# Altium project Heart Rate Monitoring.PrjPcb
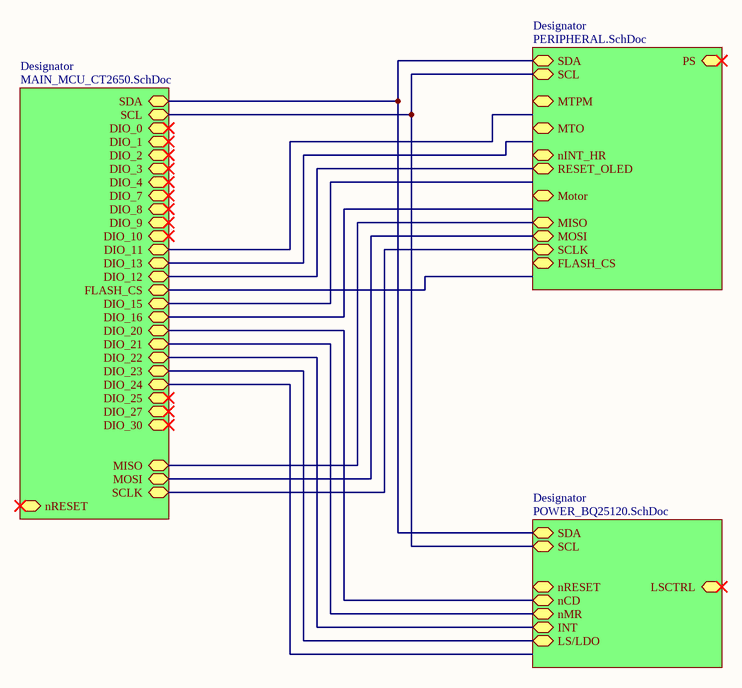
[diagram p0: HEART RATE.SchDoc]
4 sheets, 96 parts. Net scope: hierarchical (ports join the sheet entries above them; power ports are global).
Sheets:
  HEART RATE.SchDoc
    Designator = POWER_BQ25120.SchDoc
    Designator = MAIN_MCU_CT2650.SchDoc
    Designator = PERIPHERAL.SchDoc

## Sheet HEART RATE.SchDoc
size A

### Sub-sheets
Designator = POWER_BQ25120.SchDoc: SDA, SCL, nRESET, nMR, nCD, LSCTRL, LS/LDO, INT
Designator = MAIN_MCU_CT2650.SchDoc: DIO_0, DIO_1, DIO_2, DIO_3, DIO_4, DIO_7, DIO_10, DIO_11, DIO_12, DIO_13, DIO_15, DIO_16, DIO_20, DIO_21, DIO_22, DIO_23, DIO_24, DIO_25, DIO_27, DIO_30, MISO, MOSI, SCLK, SCL, SDA, FLASH_CS, DIO_8, DIO_9, nRESET
Designator = PERIPHERAL.SchDoc: SDA, SCL, RESET_OLED, nINT_HR, MTPM, MTO, Motor, MOSI, MISO, SCLK, FLASH_CS, PS

### Nets
NetC35_2: sheet Designator/LS/LDO, sheet Designator/DIO_23
NetR2_2: sheet Designator/SCL, sheet Designator/SCL, sheet Designator/SCL
NetR3_2: sheet Designator/SDA, sheet Designator/SDA, sheet Designator/SDA
NetR18_1: sheet Designator/nMR, sheet Designator/DIO_21
NetR22_1: sheet Designator/INT, sheet Designator/DIO_22
NetU1_18: sheet Designator/DIO_12, sheet Designator/RESET_OLED
NetU1_27: sheet Designator/SCLK, sheet Designator/SCLK
NetU1_28: sheet Designator/MISO, sheet Designator/MISO
NetU1_29: sheet Designator/MOSI, sheet Designator/MOSI
NetU1_30: sheet Designator/nCD, sheet Designator/DIO_20

## Sheet POWER_BQ25120.SchDoc
size A
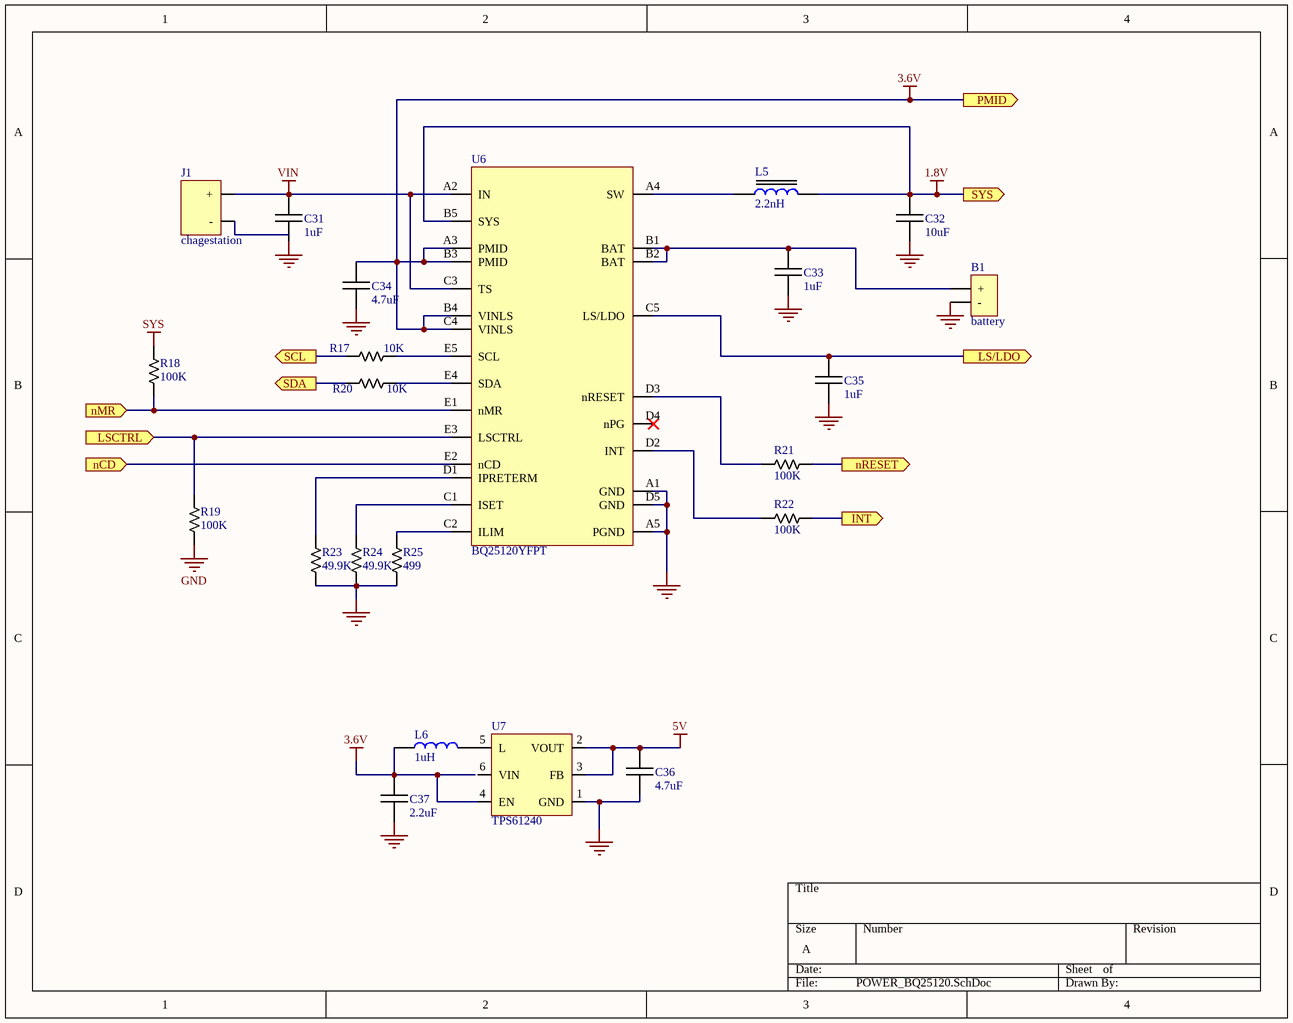
[diagram p1: POWER_BQ25120.SchDoc]

### Parts
B1  battery
C31  1uF
C32  10uF
C33  1uF
C34  4.7uF  [C0603]
C35  1uF
C36  4.7uF
C37  2.2uF
J1  chagestation
L5  2.2nH
L6  1uH
R17  10K  [R0603]
R18  100K  [R0603]
R19  100K  [R0603]
R20  10K  [R0603]
R21  100K  [R0603]
R22  100K  [R0603]
R23  49.9K
R24  49.9K
R25  499
U6  BQ25120YFPT
U7  TPS61240

### Ports
INT (out), LS/LDO (out), LSCTRL (in), nCD (in), nMR (in), nRESET (out), PMID (out), SCL (out), SDA (out), SYS (out)

### Nets
1.8V: C32.2 L5.2 U6.B5(SYS) ; port SYS
3.6V: C34.2 C37.2 L6.1 U6.A3(PMID) U6.B3(PMID) U6.B4(VINLS) U6.C4(VINLS) U7.4(EN) ; port PMID
5V: C36.2 U7.2(VOUT) U7.3(FB)
GND: B1.- C31.1 C32.1 C33.1 C34.1 C35.1 C36.1 C37.1 R19.1 R23.1 R24.1 R25.1 U6.A1(GND) U6.A5(PGND) U6.D5(GND) U7.1(GND)
SYS: R18.2
VIN: C31.2 J1.+ U6.A2(IN) U6.C3(TS)
NetB1_+: B1.+ C33.2 U6.B1(BAT) U6.B2(BAT)
NetC35_2: C35.2 U6.C5(LS/LDO) ; port LS/LDO
NetL5_1: L5.1 U6.A4(SW)
NetL6_2: L6.2 U7.5(L)
NetR2_2: R17.1 ; port SCL
NetR3_2: R20.1 ; port SDA
NetR17_2: R17.2 U6.E5(SCL)
NetR18_1: R18.1 U6.E1(nMR) ; port nMR
NetR19_2: R19.2 U6.E3(LSCTRL) ; port LSCTRL
NetR20_2: R20.2 U6.E4(SDA)
NetR21_1: R21.1 ; port nRESET
NetR21_2: R21.2 U6.D3(nRESET)
NetR22_1: R22.1 ; port INT
NetR22_2: R22.2 U6.D2(INT)
NetR23_2: R23.2 U6.D1(IPRETERM)
NetR24_2: R24.2 U6.C1(ISET)
NetR25_2: R25.2 U6.C2(ILIM)
NetU1_30: U6.E2(nCD) ; port nCD

Not connected (* = marked no-connect by the designer): J1 -; U6 D4(nPG)*; U7 6(VIN)

### Library data of the parts
B1 = Battery: 100MAH; website: https://www.adafruit.com/product/1570
C31 C33 C35 = C1uF_0402: SMD_CAPACITOR; Voltage - Rated: 10V; Tolerance: ±10%; Packet: 0402; Digi-Key Part Number: 490-3890-1-ND; Capacitance: 1uF
C32 = C10uF_0603: SMD_CAPACITOR; Voltage - Rated: 6.3V; Tolerance: ±20%; Packet: 0603; Digi-Key Part Number: 490-3896-1-ND; Capacitance: 10uF
C34 = C4.7u_0603: SMD_CAPACITOR; Voltage - Rated: 16V; Tolerance: ±10%; Packet: 0603; Digi-Key Part Number: 311-1785-1-ND; Capacitance: 4.7uF
C36 = C4.7uF_0402: SMD_CAPACITOR; Voltage - Rated: 6.3V; Tolerance: ±20%; Packet: 0402; Digi-Key Part Number: 587-2787-1-ND; Capacitance: 4.7uF
C37 = C2.2uF_0402: SMD_CAPACITOR; Voltage - Rated: 6.3V; Tolerance: ±20%; Packet: 0402; Digi-Key Part Number: 587-1453-1-ND; Capacitance: 2.2uF
L5 = L2.2nH_0201: SMD_Inductor; Digi-Key Part Number: LQP03TG2N2C02D; Inductance: 2.2nH; Package: 0201
L6 = L1uH_0603: SMD_Inductor; Digi-Key Part Number: 490-15634-1-ND; Inductance: 1uH; Package: 0603
R17 R20 = R10K_0201: SMD_RESISTOR; Packet: 0201; Tolerance: ±5%; Power: 1/20W; Digi-Key Part Number: 311-10KNCT-ND; Value: 10K
R18 R19 R21 R22 = R100K_0402: SMD_RESISTOR; Packet: 0402; Tolerance: ±5%; Power: 1/16W; Digi-Key Part Number: 541-2190-1-ND; Value: 100K
R23 R24 = R49.9K_0402: SMD_RESISTOR; Packet: 0402; Tolerance: ±1%; Power: 1/16W; Digi-Key Part Number: 311-49.9KLRCT-ND; Value: 49.9K
R25 = R499_0402: SMD_RESISTOR; Packet: 0402; Tolerance: ±1%; Power: 1/16W; Digi-Key Part Number: 311-499LRCT-ND; Value: 499
U6 = BQ25120YFF: Digi-Key Part Number: 296-42554-1-ND
U7 = TPS61240: IC REG BOOST 5V 0.5A SYNC 6SON; Digi-Key Part Number: 296-39437-1-ND

## Sheet MAIN_MCU_CT2650.SchDoc
size B
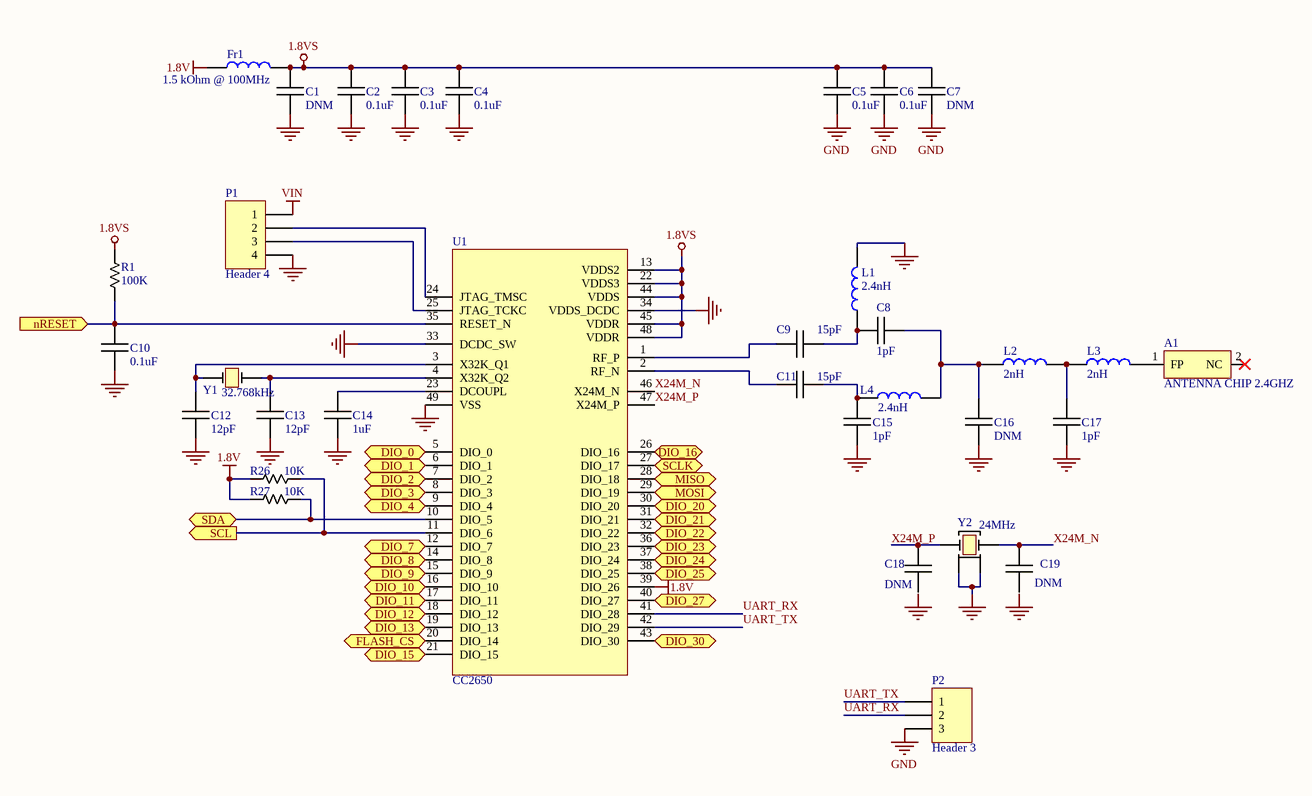
[diagram p2: MAIN_MCU_CT2650.SchDoc]

### Parts
A1  ANTENNA CHIP 2.4GHZ
C1  DNM
C2  0.1uF
C3  0.1uF
C4  0.1uF
C5  0.1uF
C6  0.1uF
C7  DNM
C8  1pF
C9  15pF
C10  0.1uF
C11  15pF
C12  12pF
C13  12pF
C14  1uF
C15  1pF
C16  DNM
C17  1pF
C18  DNM
C19  DNM
Fr1  1.5 kOhm @ 100MHz
L1  2.4nH
L2  2nH
L3  2nH
L4  2.4nH
P1  Header 4  [HDR1X4]
P2  Header 3  [HDR1X3]
R1  100K  [R0603]
R26  10K  [R0603]
R27  10K  [R0603]
U1  CC2650
Y1  32.768kHz
Y2  24MHz

### Ports
DIO_0 (bidir), DIO_1 (bidir), DIO_2 (bidir), DIO_3 (bidir), DIO_4 (bidir), DIO_7 (bidir), DIO_8 (bidir), DIO_9 (bidir), DIO_10 (bidir), DIO_11 (bidir), DIO_12 (bidir), DIO_13 (bidir), DIO_15 (bidir), DIO_16 (bidir), DIO_20 (bidir), DIO_21 (bidir), DIO_22 (bidir), DIO_23 (bidir), DIO_24 (bidir), DIO_25 (bidir), DIO_27 (bidir), DIO_30 (bidir), FLASH_CS (bidir), MISO (in), MOSI (out), nRESET (in), SCL (out), SCLK (bidir), SDA (bidir)

### Nets
1.8V: Fr1.1 R26.1 R27.1 U1.39(DIO_26)
1.8VS: C1.2 C2.2 C3.2 C4.2 C5.2 C6.2 C7.2 Fr1.2 R1.2 U1.13(VDDS2) U1.22(VDDS3) U1.44(VDDS) U1.45(VDDR) U1.48(VDDR)
GND: C1.1 C2.1 C3.1 C4.1 C5.1 C6.1 C7.1 C10.1 C12.1 C13.1 C14.1 C15.1 C16.1 C17.1 L1.2 P1.4 P2.3 U1.33(DCDC_SW) U1.34(VDDS_DCDC) U1.49(VSS) Y2.2 Y2.4
VIN: P1.1
UART_RX: P2.2 U1.41(DIO_28)
UART_TX: P2.1 U1.42(DIO_29)
X24M_N: U1.46(X24M_N)
X24M_P: U1.47(X24M_P)
NetA1_1: A1.1(FP) L3.2
NetC8_1: C8.1 C9.2 L1.1
NetC8_2: C8.2 C16.2 L2.1 L4.2
NetC9_1: C9.1 U1.1(RF_P)
NetC10_2: C10.2 R1.1 U1.35(RESET_N) ; port nRESET
NetC11_1: C11.1 U1.2(RF_N)
NetC11_2: C11.2 C15.2 L4.1
NetC12_2: C12.2 U1.3(X32K_Q1) Y1.1
NetC13_2: C13.2 U1.4(X32K_Q2) Y1.2
NetC14_2: C14.2 U1.23(DCOUPL)
NetC17_2: C17.2 L2.2 L3.1
NetC18_2: C18.2 Y2.1
NetC19_2: C19.2 Y2.3
NetC35_2: U1.36(DIO_23) ; port DIO_23
NetP1_2: P1.2 U1.24(JTAG_TMSC)
NetP1_3: P1.3 U1.25(JTAG_TCKC)
NetR2_2: R26.2 U1.11(DIO_6) ; port SCL
NetR3_2: R27.2 U1.10(DIO_5) ; port SDA
NetR18_1: U1.31(DIO_21) ; port DIO_21
NetR22_1: U1.32(DIO_22) ; port DIO_22
NetU1_5: U1.5(DIO_0) ; port DIO_0
NetU1_6: U1.6(DIO_1) ; port DIO_1
NetU1_7: U1.7(DIO_2) ; port DIO_2
NetU1_8: U1.8(DIO_3) ; port DIO_3
NetU1_9: U1.9(DIO_4) ; port DIO_4
NetU1_12: U1.12(DIO_7) ; port DIO_7
NetU1_14: U1.14(DIO_8) ; port DIO_8
NetU1_15: U1.15(DIO_9) ; port DIO_9
NetU1_16: U1.16(DIO_10) ; port DIO_10
NetU1_17: U1.17(DIO_11) ; port DIO_11
NetU1_18: U1.18(DIO_12) ; port DIO_12
NetU1_19: U1.19(DIO_13) ; port DIO_13
NetU1_20: U1.20(DIO_14) ; port FLASH_CS
NetU1_21: U1.21(DIO_15) ; port DIO_15
NetU1_26: U1.26(DIO_16) ; port DIO_16
NetU1_27: U1.27(DIO_17) ; port SCLK
NetU1_28: U1.28(DIO_18) ; port MISO
NetU1_29: U1.29(DIO_19) ; port MOSI
NetU1_30: U1.30(DIO_20) ; port DIO_20
NetU1_37: U1.37(DIO_24) ; port DIO_24
NetU1_38: U1.38(DIO_25) ; port DIO_25
NetU1_40: U1.40(DIO_27) ; port DIO_27
NetU1_43: U1.43(DIO_30) ; port DIO_30

Not connected (* = marked no-connect by the designer): A1 2(NC)*; C18 1; C19 1

### Notes on the sheet
- Labels drawn without touching a wire or pin: GND, X24M_N, X24M_P

### Library data of the parts
C1 C7 C16 C18 C19 = DNM: SMD_CAPACITOR; Packet: 0402; Capacitance: DNM
C2-C6 C10 = C0.1uF_0402: SMD_CAPACITOR; Voltage - Rated: 6.3V; Tolerance: ±10%; Packet: 0402; Digi-Key Part Number: 490-6319-1-ND; Capacitance: 0.1uF
C8 C15 C17 = C1pF_0402: SMD_CAPACITOR; Voltage - Rated: 50V; Tolerance: ±0.25pF; Packet: 0402; Digi-Key Part Number: 490-3199-1-ND; Capacitance: 1pF
C9 C11 = C15pF_0603: SMD_CAPACITOR; Voltage - Rated: 50V; Tolerance: ±5%; Packet: 0402; Digi-Key Part Number: 712-1261-1-ND; Capacitance: 15pF
C12 C13 = C12pF_0402: SMD_CAPACITOR; Voltage - Rated: 50V; Tolerance: ±5%; Packet: 0402; Digi-Key Part Number: 490-5924-1-ND; Capacitance: 12pF
C14 = C1uF_0402: as C31 on sheet POWER_BQ25120; Digi-Key Part Number: 490-3890-1-ND; Capacitance: 1uF
Fr1 = Fr1.5 kOhm: SMD_Ferrite Beads; Digi-Key Part Number: 490-5216-1-ND; Inductance: 1.5 kOhm @ 100MHz; Package: 0603
L1 L4 = L2.4nH_0402: SMD_Inductor; Digi-Key Part Number: 490-8389-1-ND; Inductance: 2.4nH; Package: 0402
L2 L3 = L2nH_0402: SMD_Inductor; Digi-Key Part Number: 490-6569-1-ND; Inductance: 2nH; Package: 0402
P1 = Header 4: Header, 4-Pin; LatestRevisionDate: 17-Jul-2002; LatestRevisionNote: Re-released for DXP Platform.; Publisher: Altium Limited
P2 = Header 3: Header, 3-Pin; LatestRevisionDate: 17-Jul-2002; LatestRevisionNote: Re-released for DXP Platform.; Publisher: Altium Limited
R1 = R100K_0402: as R18 on sheet POWER_BQ25120; Digi-Key Part Number: 541-2190-1-ND; Value: 100K
R26 R27 = R10K_0201: as R17 on sheet POWER_BQ25120; Digi-Key Part Number: 311-10KNCT-ND; Value: 10K
U1 = CC2650F128RGZR: IC RF TXRX+MCU 802.15.4/BT 48QFN; Packet: 48-VFQFN Exposed Pad; Digi-Key Part Number: 296-44316-1-ND
Y1 = 32.7680KHz_SMD: Crystal; Load Capacitance: 12.5pF; Frequency: 32.768kHz; Digi-Key Part Number: SER4077CT-ND
Y2 = 24MHz_SMD: Crystal; Load Capacitance: 9pF; Frequency: 24MHz; Digi-Key Part Number: SER3635CT-ND
A1 = ANTENNA CHIP 2.4GHZ: Digi-Key Part Number: 712-1006-1-ND

## Sheet PERIPHERAL.SchDoc
size A
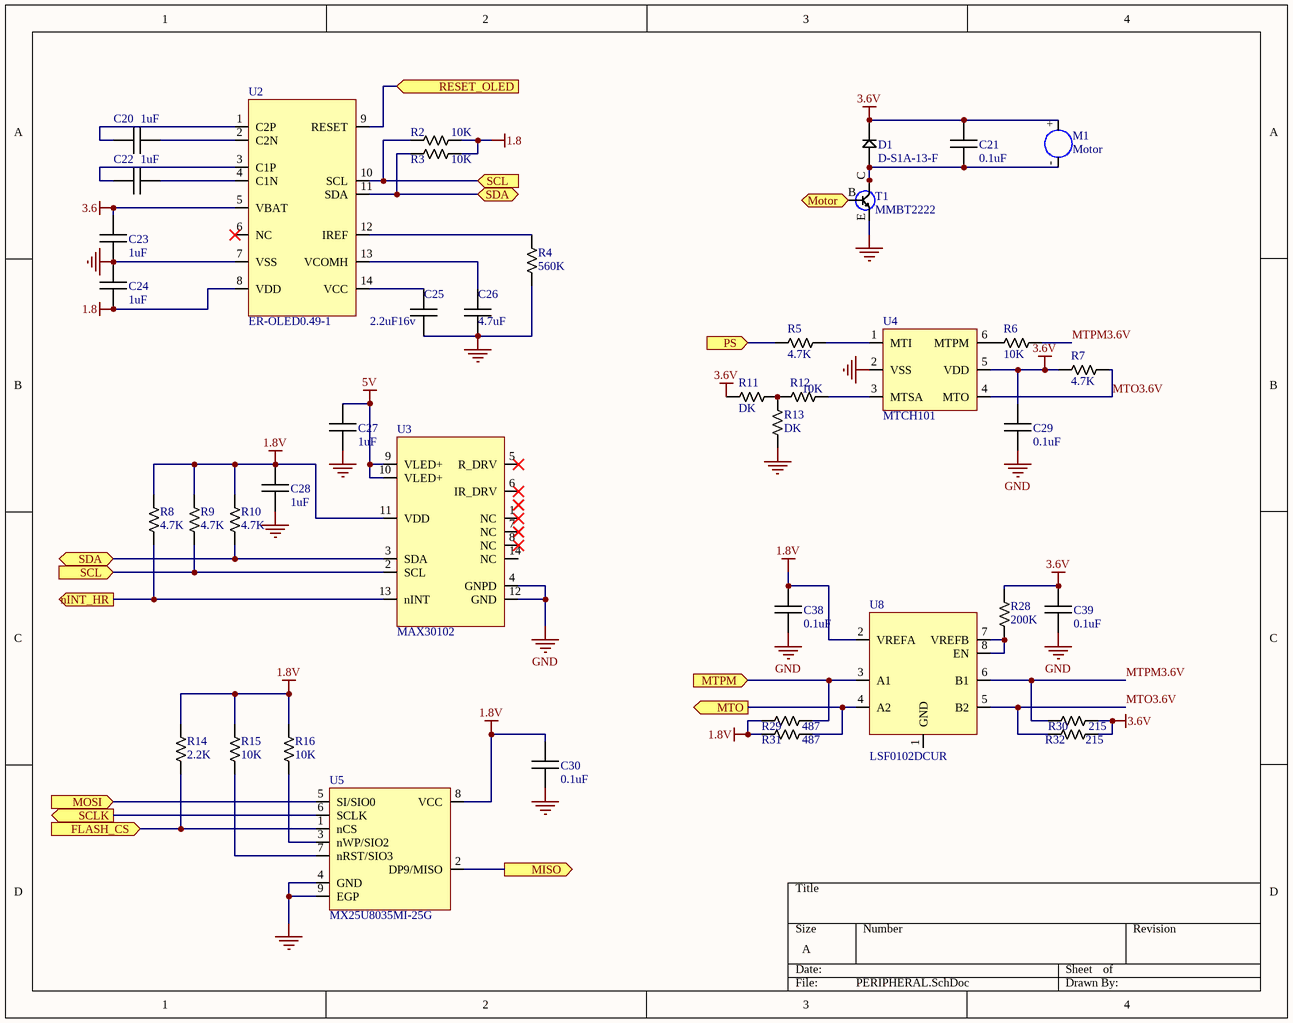
[diagram p3: PERIPHERAL.SchDoc]

### Parts
C20  1uF
C21  0.1uF
C22  1uF
C23  1uF
C24  1uF
C25  2.2uF16v
C26  4.7uF
C27  1uF
C28  1uF
C29  0.1uF
C30  0.1uF
C38  0.1uF
C39  0.1uF
D1  D-S1A-13-F
M1  Motor
R2  10K  [R0603]
R3  10K  [R0603]
R4  560K  [R0603]
R5  4.7K  [R0603]
R6  10K  [R0603]
R7  4.7K  [R0603]
R8  4.7K  [R0603]
R9  4.7K  [R0603]
R10  4.7K  [R0603]
R11  DK  [R0603]
R12  10K  [R0603]
R13  DK  [R0603]
R14  2.2K
R15  10K  [R0603]
R16  10K  [R0603]
R28  200K  [R0603]
R29  487  [R0603]
R30  215  [R0603]
R31  487  [R0603]
R32  215  [R0603]
T1  MMBT2222
U2  ER-OLED0.49-1
U3  MAX30102
U4  MTCH101
U5  MX25U8035MI-25G
U8  LSF0102DCUR

### Ports
FLASH_CS (in), MISO (out), MOSI (in), Motor (in), MTO (out), MTPM (in), nINT_HR (out), PS (in), RESET_OLED (in), SCL (in), SCLK (out), SDA (bidir)

### Nets
1.8: C24.2 R2.1 R3.1 U2.8(VDD)
1.8V: C28.2 C30.2 C38.2 R8.2 R9.2 R10.2 R14.2 R15.2 R16.2 R29.2 R31.2 U3.11(VDD) U5.8(VCC) U8.2(VREFA)
3.6: C23.2 U2.5(VBAT)
3.6V: C21.2 C29.2 C39.2 D1.1(-) M1.+ R7.2 R11.1 R28.2 R30.2 R32.2 U4.5(VDD)
5V: C27.2 U3.9(VLED+) U3.10(VLED+)
GND: C23.1 C24.1 C25.1 C26.1 C27.1 C28.1 C29.1 C30.1 C38.1 C39.1 R4.1 R13.1 T1.E U2.7(VSS) U3.4(GNPD) U3.12(GND) U4.2(VSS) U5.4(GND) U5.9(EGP)
MTO3.6V: R7.1 R32.1 U4.4(MTO) U8.5(B2)
MTPM3.6V: R6.2 R30.1 U8.6(B1)
NetC20_1: C20.1 U2.2(C2N)
NetC20_2: C20.2 U2.1(C2P)
NetC21_1: C21.1 D1.2(+) M1.- T1.C
NetC22_1: C22.1 U2.4(C1N)
NetC22_2: C22.2 U2.3(C1P)
NetC25_2: C25.2 U2.14(VCC)
NetC26_2: C26.2 U2.13(VCOMH)
NetR2_2: R2.2 R9.1 U2.10(SCL) U3.2(SCL) ; port SCL
NetR3_2: R3.2 R10.1 U2.11(SDA) U3.3(SDA) ; port SDA
NetR4_2: R4.2 U2.12(IREF)
NetR5_1: R5.1 ; port PS
NetR5_2: R5.2 U4.1(MTI)
NetR6_1: R6.1 U4.6(MTPM)
NetR8_1: R8.1 U3.13(nINT) ; port nINT_HR
NetR11_2: R11.2 R12.1 R13.2
NetR12_2: R12.2 U4.3(MTSA)
NetR14_1: R14.1 U5.1(nCS) ; port FLASH_CS
NetR15_1: R15.1 U5.7(nRST/SIO3)
NetR16_1: R16.1 U5.3(nWP/SIO2)
NetR28_1: R28.1 U8.7(VREFB) U8.8(EN)
NetR29_1: R29.1 U8.3(A1) ; port MTPM
NetR31_1: R31.1 U8.4(A2) ; port MTO
NetT1_B: T1.B ; port Motor
NetU1_18: U2.9(RESET) ; port RESET_OLED
NetU1_27: U5.6(SCLK) ; port SCLK
NetU1_28: U5.2(DP9/MISO) ; port MISO
NetU1_29: U5.5(SI/SIO0) ; port MOSI

Not connected (* = marked no-connect by the designer): U2 6(NC)*; U3 1(NC)* 5(R_DRV)* 6(IR_DRV)* 7(NC)* 8(NC)* 14(NC); U8 1(GND)

### Library data of the parts
C20 C22-C24 C27 C28 = C1uF_0402: as C31 on sheet POWER_BQ25120; Digi-Key Part Number: 490-3890-1-ND; Capacitance: 1uF
C21 C29 C30 C38 C39 = C0.1uF_0402: as C2 on sheet MAIN_MCU_CT2650; Digi-Key Part Number: 490-6319-1-ND; Capacitance: 0.1uF
C25 = C2.2uF_0805: SMD_CAPACITOR; Voltage - Rated: 16V; Tolerance: ±10%; Packet: 0805; Digi-Key Part Number: 490-3906-1-ND; Capacitance: 2.2uF16v
C26 = C4.7uF_0805: SMD_CAPACITOR; Voltage - Rated: 16V; Tolerance: ±10%; Packet: 0805; Digi-Key Part Number: 445-1385-1-ND; Capacitance: 4.7uF
D1 = D-S1A-13-F: ="Description"; Description: DIODE GEN PURP 50V 1A SMA; Package: DO-214AC, SMA
M1 = Motor: vibrator coin 7mm; Digi-Key Part Number: 1670-1000-ND
R2 R3 R6 R12 R15 R16 = R10K_0201: as R17 on sheet POWER_BQ25120; Digi-Key Part Number: 311-10KNCT-ND; Value: 10K
R4 = R560K_0402: SMD_RESISTOR; Packet: 0402; Tolerance: ±5%; Power: 1/16W; Digi-Key Part Number: 311-560KJRCT-ND; Value: 560K
R5 R7-R10 = R4.7K_0402: SMD_RESISTOR; Packet: 0402; Tolerance: ±1%; Power: 1/16W; Digi-Key Part Number: 311-4.7KLRCT-ND; Value: 4.7K
R11 R13 = RDK_0402: SMD_RESISTOR; Packet: 0402; Value: DK
R14 = R2.2K_0402: SMD_RESISTOR; Packet: 0402; Tolerance: ±1%; Power: 1/16W; Digi-Key Part Number: 311-2.20KLRCT-ND; Value: 2.2K
R28 = R200K_0201: SMD_RESISTOR; Packet: 0201; Tolerance: ±1%; Power: 1/20W; Digi-Key Part Number: 541-200KAABCT-ND; Value: 200K
R29 R31 = R487_0402: SMD_RESISTOR; Packet: 0402; Tolerance: ±1%; Power: 1/16W; Digi-Key Part Number: YAG2373CT-ND; Value: 487
R30 R32 = R215_0402: SMD_RESISTOR; Packet: 0402; Tolerance: ±1%; Power: 1/16W; Digi-Key Part Number: YAG3056TR-ND; Value: 215
T1 = MMBT2222: SMD_Transistor; Digi-Key Part Number: MMBT2222ALT1GOSCT-ND
U2 = ER-OLED0.49-1: OLED0.49; Website: http://www.buydisplay.com/default/low-power-smallest-blue-i2c-0-49-inch-64x32-oled-module-display-ssd1306
U3 = MAX30102: Heart rate; Digi-Key Part Number: MAX30102EFD+-ND
U4 = MTCH101: IC PROXIMITY DETECTOR SOT23-6; Digi-Key Part Number: MTCH101-I/OT-ND
U5 = MX25U8035MI-25G: IC FLASH 8MBIT 40MHZ 8SOP; Digi-Key Part Number: 1092-1119-ND
U8 = LSF0102DCUR: IC LEVEL TRANSLATOR BIDIR US8; Digi-Key Part Number: 296-39070-1-ND

## Nets that join several sheets
1.8V: POWER_BQ25120 (C32.2 L5.2 U6.B5), MAIN_MCU_CT2650 (Fr1.1 R26.1 R27.1 U1.39), PERIPHERAL (14 pins)
3.6V: POWER_BQ25120 (8 pins), PERIPHERAL (11 pins)
5V: POWER_BQ25120 (C36.2 U7.2 U7.3), PERIPHERAL (C27.2 U3.9 U3.10)
GND: POWER_BQ25120 (16 pins), MAIN_MCU_CT2650 (22 pins), PERIPHERAL (19 pins)
VIN: POWER_BQ25120 (C31.2 J1.+ U6.A2 U6.C3), MAIN_MCU_CT2650 (P1.1)
NetC35_2: POWER_BQ25120 (C35.2 U6.C5), MAIN_MCU_CT2650 (U1.36)
NetR2_2: POWER_BQ25120 (R17.1), MAIN_MCU_CT2650 (R26.2 U1.11), PERIPHERAL (R2.2 R9.1 U2.10 U3.2)
NetR3_2: POWER_BQ25120 (R20.1), MAIN_MCU_CT2650 (R27.2 U1.10), PERIPHERAL (R3.2 R10.1 U2.11 U3.3)
NetR18_1: POWER_BQ25120 (R18.1 U6.E1), MAIN_MCU_CT2650 (U1.31)
NetR22_1: POWER_BQ25120 (R22.1), MAIN_MCU_CT2650 (U1.32)
NetU1_18: MAIN_MCU_CT2650 (U1.18), PERIPHERAL (U2.9)
NetU1_27: MAIN_MCU_CT2650 (U1.27), PERIPHERAL (U5.6)
NetU1_28: MAIN_MCU_CT2650 (U1.28), PERIPHERAL (U5.2)
NetU1_29: MAIN_MCU_CT2650 (U1.29), PERIPHERAL (U5.5)
NetU1_30: POWER_BQ25120 (U6.E2), MAIN_MCU_CT2650 (U1.30)